# EasyEDA schematic schematic_diagram.json
TITLE: Waste Bin; REV: 1.0; Date: 2023-11-09; Sheet: 1/1
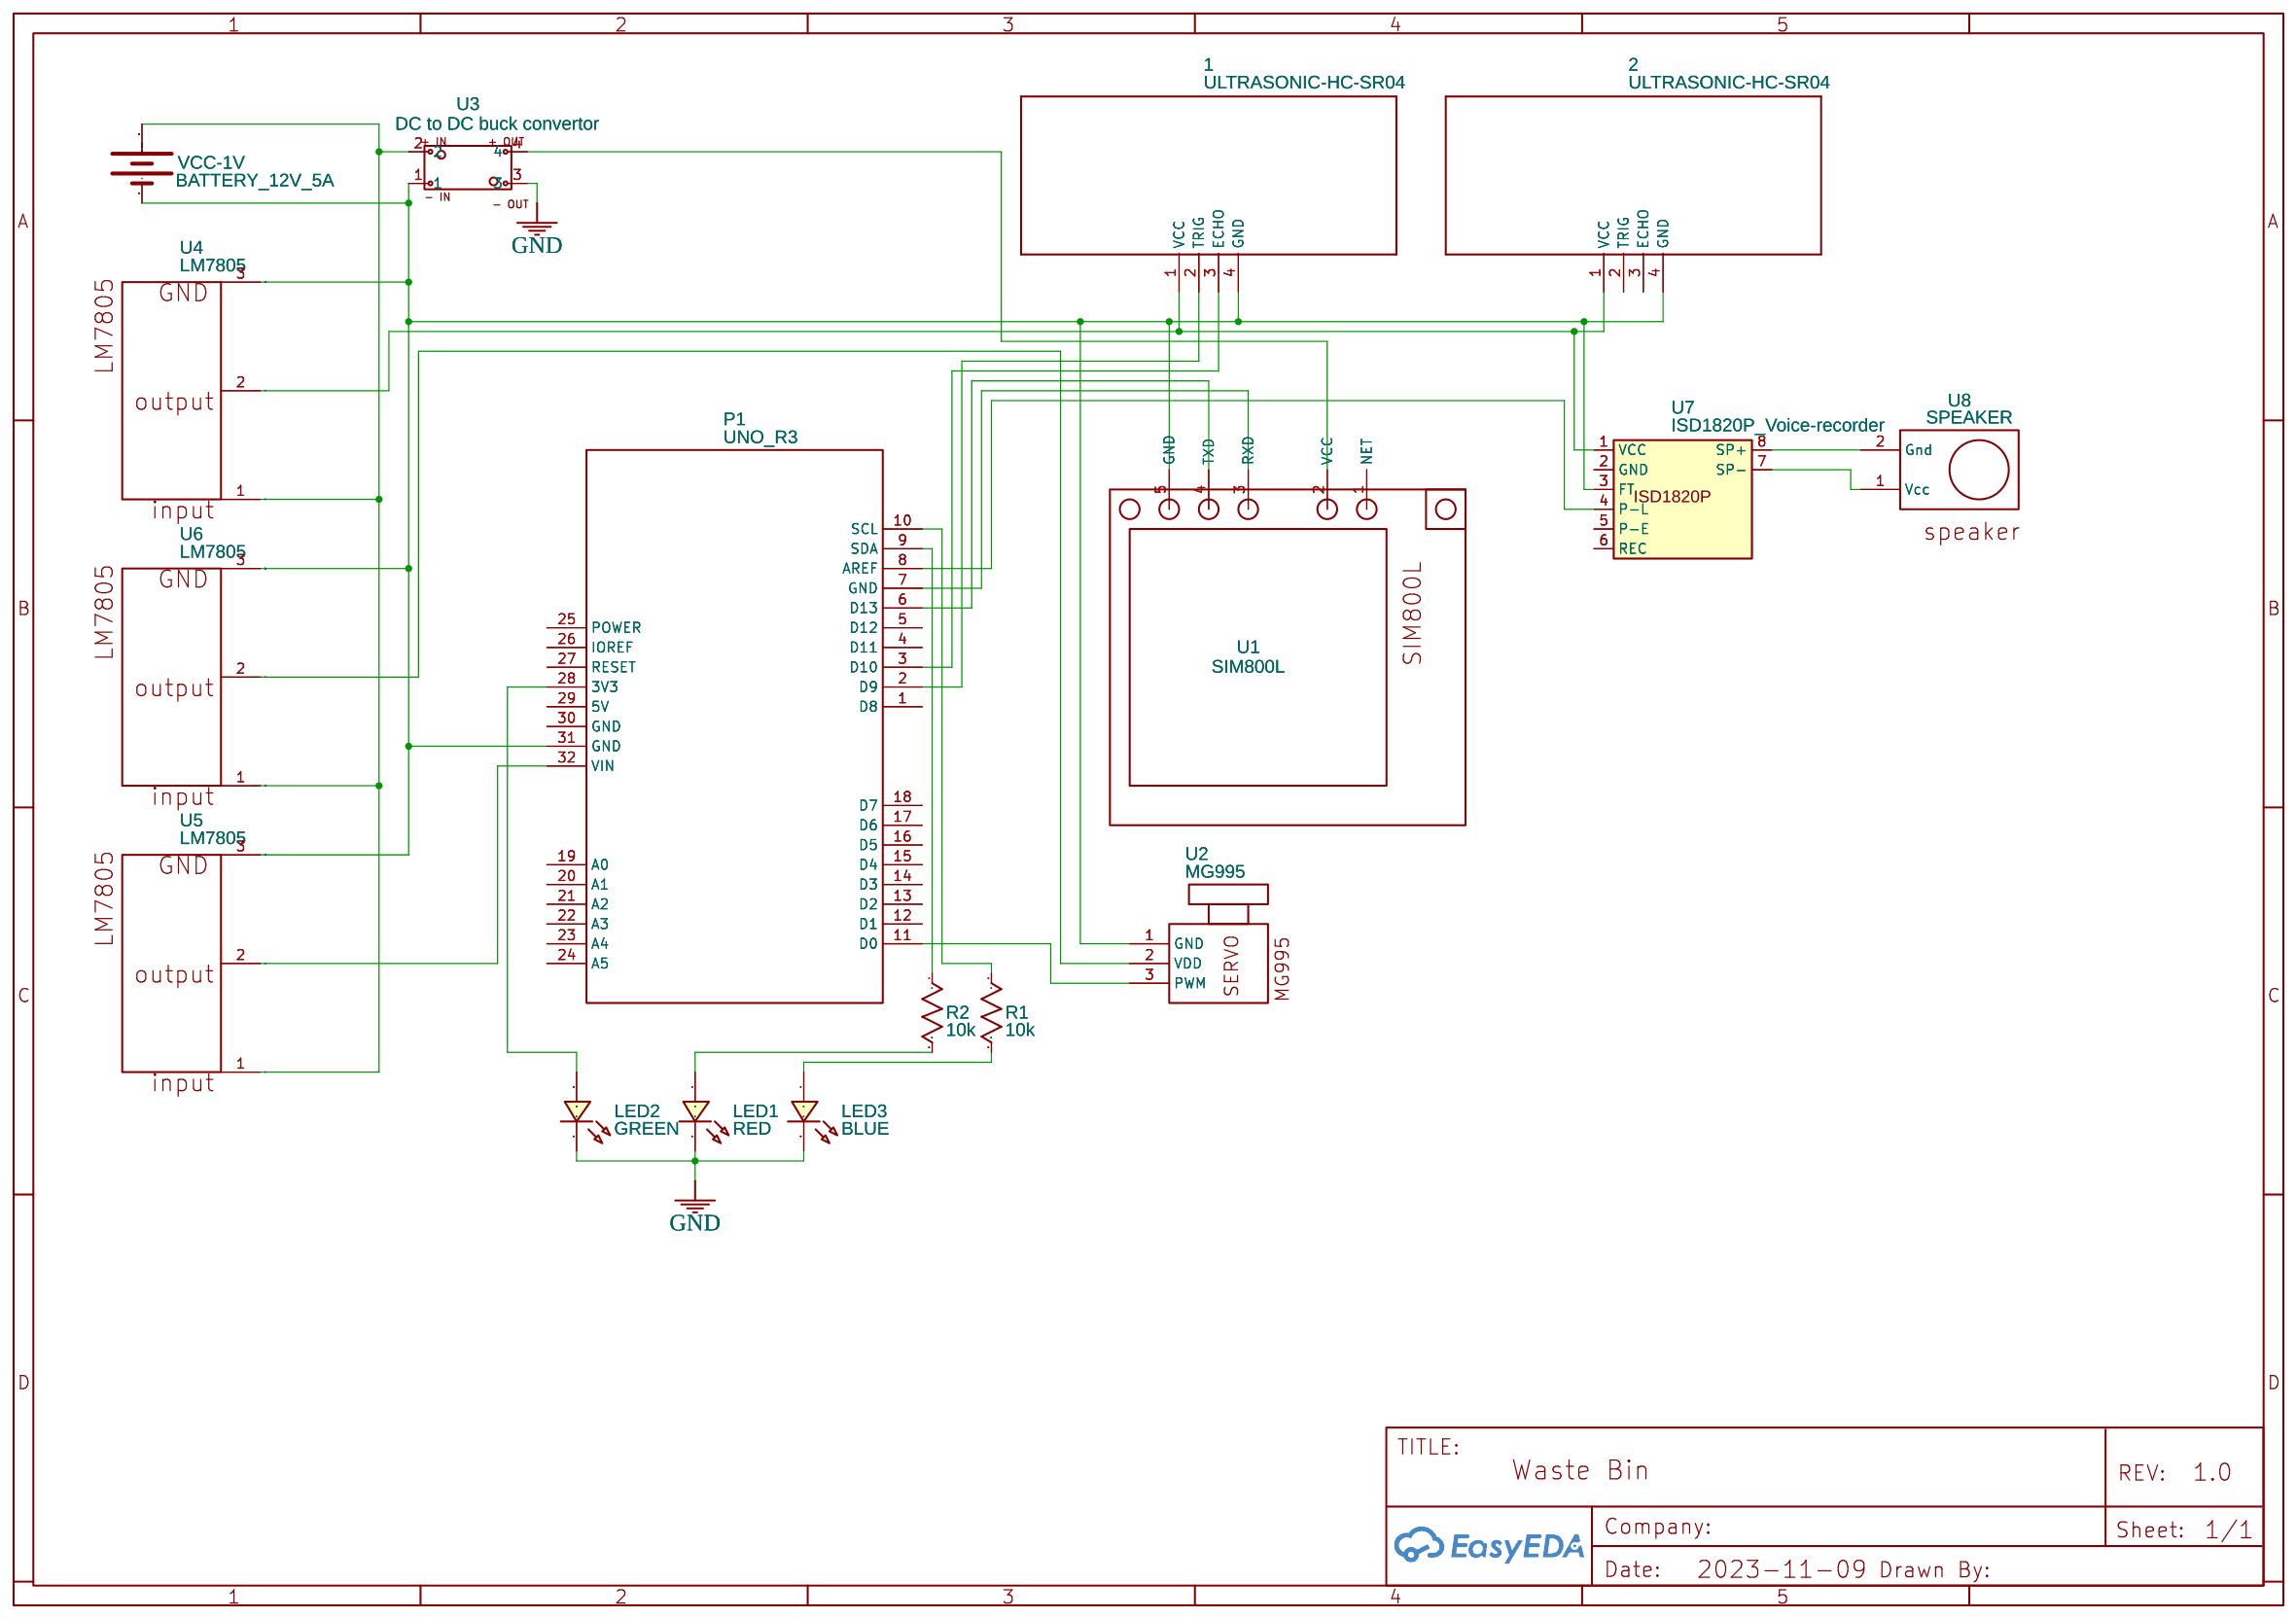
[diagram p0: schematic sheet]

## Parts
1  ULTRASONIC-HC-SR04  [ULTRASONIC-HC-SR04]
2  ULTRASONIC-HC-SR04  [ULTRASONIC-HC-SR04]
LED1  RED  [LED0603_RED]
LED2  GREEN  [LED0603_GREEN]
LED3  BLUE  [LED0603_BLUE]
P1  UNO_R3  [UNO_R3]
R1  10k  [R0603]
R2  10k  [R0603]
U1  SIM800L  [SIM800L]
U2  MG995  [NEWSERVOPCB]
U3  DC to DC buck convertor  [DC TO DC CONVERTOR]
U4  LM7805  [LM7805NN]
U5  LM7805  [LM7805NN]
U6  LM7805  [LM7805NN]
U7  ISD1820P_Voice-recorder  [FP SCHEDA AUDIO ISD18220P]
U8  SPEAKER  [SPEAKER]
VCC-1V  BATTERY_12V_5A  [BATTERY-12V-27A]

## Library data of the parts
1 2 = ULTRASONIC-HC-SR04: Contributor: sirapat pholwa
LED1 = LED-0603_R: Manufacturer: EVERLIGHT(台湾亿光); Manufacturer Part: 19-217/R6C-AL1M2VY/3T; Supplier Part: C72044; Supplier: LCSC; Contributor: LCEDA_01
LED2 = LED-0603_G: Manufacturer: EVERLIGHT(台湾亿光); Manufacturer Part: 19-217/GHC-YR1S2/3T; Supplier Part: C72043; Supplier: LCSC; Contributor: LCEDA_Lib
LED3 = LED-0603_B: Manufacturer: EVERLIGHT(台湾亿光); Manufacturer Part: 19-217/BHC-ZL1M2RY/3T; Supplier Part: C72041; Supplier: LCSC; Contributor: LCEDA_01
P1 = UNO_R3: sourceId: 1T5FDZYC8
R1 R2 = R_0603_US: Contributor: LCEDA_Lib
U1 = SIM800L COPY: Contributor: jeankarlos10
U2 = MG995: Manufacturer Part: ServoMotor; Contributor: srimbey
U3 = DC to DC buck convertor: Manufacturer Part: n/a; Contributor: brianbeamer
U4-U6 = LM7805: Supplier: elec; Contributor: Guest
U7 = ISD1820P_Voice-recorder: 310060021
U8 = SPEAKER: Supplier: robokits; Supplier Part: RKI-4613; link: https://robokits.co.in/arduino/arduino-accessories/mini-alarm-dc-vibration-motor-module-arduino-compatible; Contributor: klishchevskyi
VCC-1V = BATTERY_12A_27A: Contributor: karurpabe

## Nets
GND: LED1.2 LED2.2 LED3.2 U3.3
Net-(1-1): 1.1(VCC) 2.1(VCC) U7.1(VCC)
Net-(1-2): 1.2(TRIG) P1.2(D9)
Net-(1-3): 1.3(ECHO) P1.3(D10)
Net-(1-4): 1.4(GND) 2.4(GND) P1.31(GND) U2.1(GND) U3.1 U7.3(FT) VCC-1V.1(-)
Net-(LED1-1): LED1.1 R2.2
Net-(LED2-1): LED2.1 P1.28(3V3)
Net-(LED3-1): LED3.1 R1.2
Net-(P1-8): P1.8(AREF) U7.4(P-L)
Net-(P1-9): P1.9(SDA) R2.1
Net-(P1-10): P1.10(SCL) R1.1
Net-(P1-11): P1.11(D0) U2.3(PWM)
Net-(U3-2): U3.2 VCC-1V.2(+)
Net-(U7-7): U7.7(SP-) U8.1(Vcc)
Net-(U7-8): U7.8(SP+) U8.2(Gnd)

Not connected (* = marked no-connect by the designer): 2 2(TRIG) 3(ECHO); P1 1(D8) 4(D11) 5(D12) 6(D13) 7(GND) 12(D1) 13(D2) 14(D3) 15(D4) 16(D5) 17(D6) 18(D7) 19(A0) 20(A1) 21(A2) 22(A3) 23(A4) 24(A5) 25(POWER) 26(IOREF) 27(RESET) 29(5V) 30(GND) 32(VIN); U1 1(NET) 2(VCC) 3(RXD) 4(TXD) 5(GND); U2 2(VDD); U3 4; U4 1 2(7) 3(8); U5 1 2(7) 3(8); U6 1 2(7) 3(8); U7 2(GND) 5(P-E) 6(REC)
